# EAGLE design SparkFun_Opto_Isolator_Breakout (EAGLE 9.6.2)
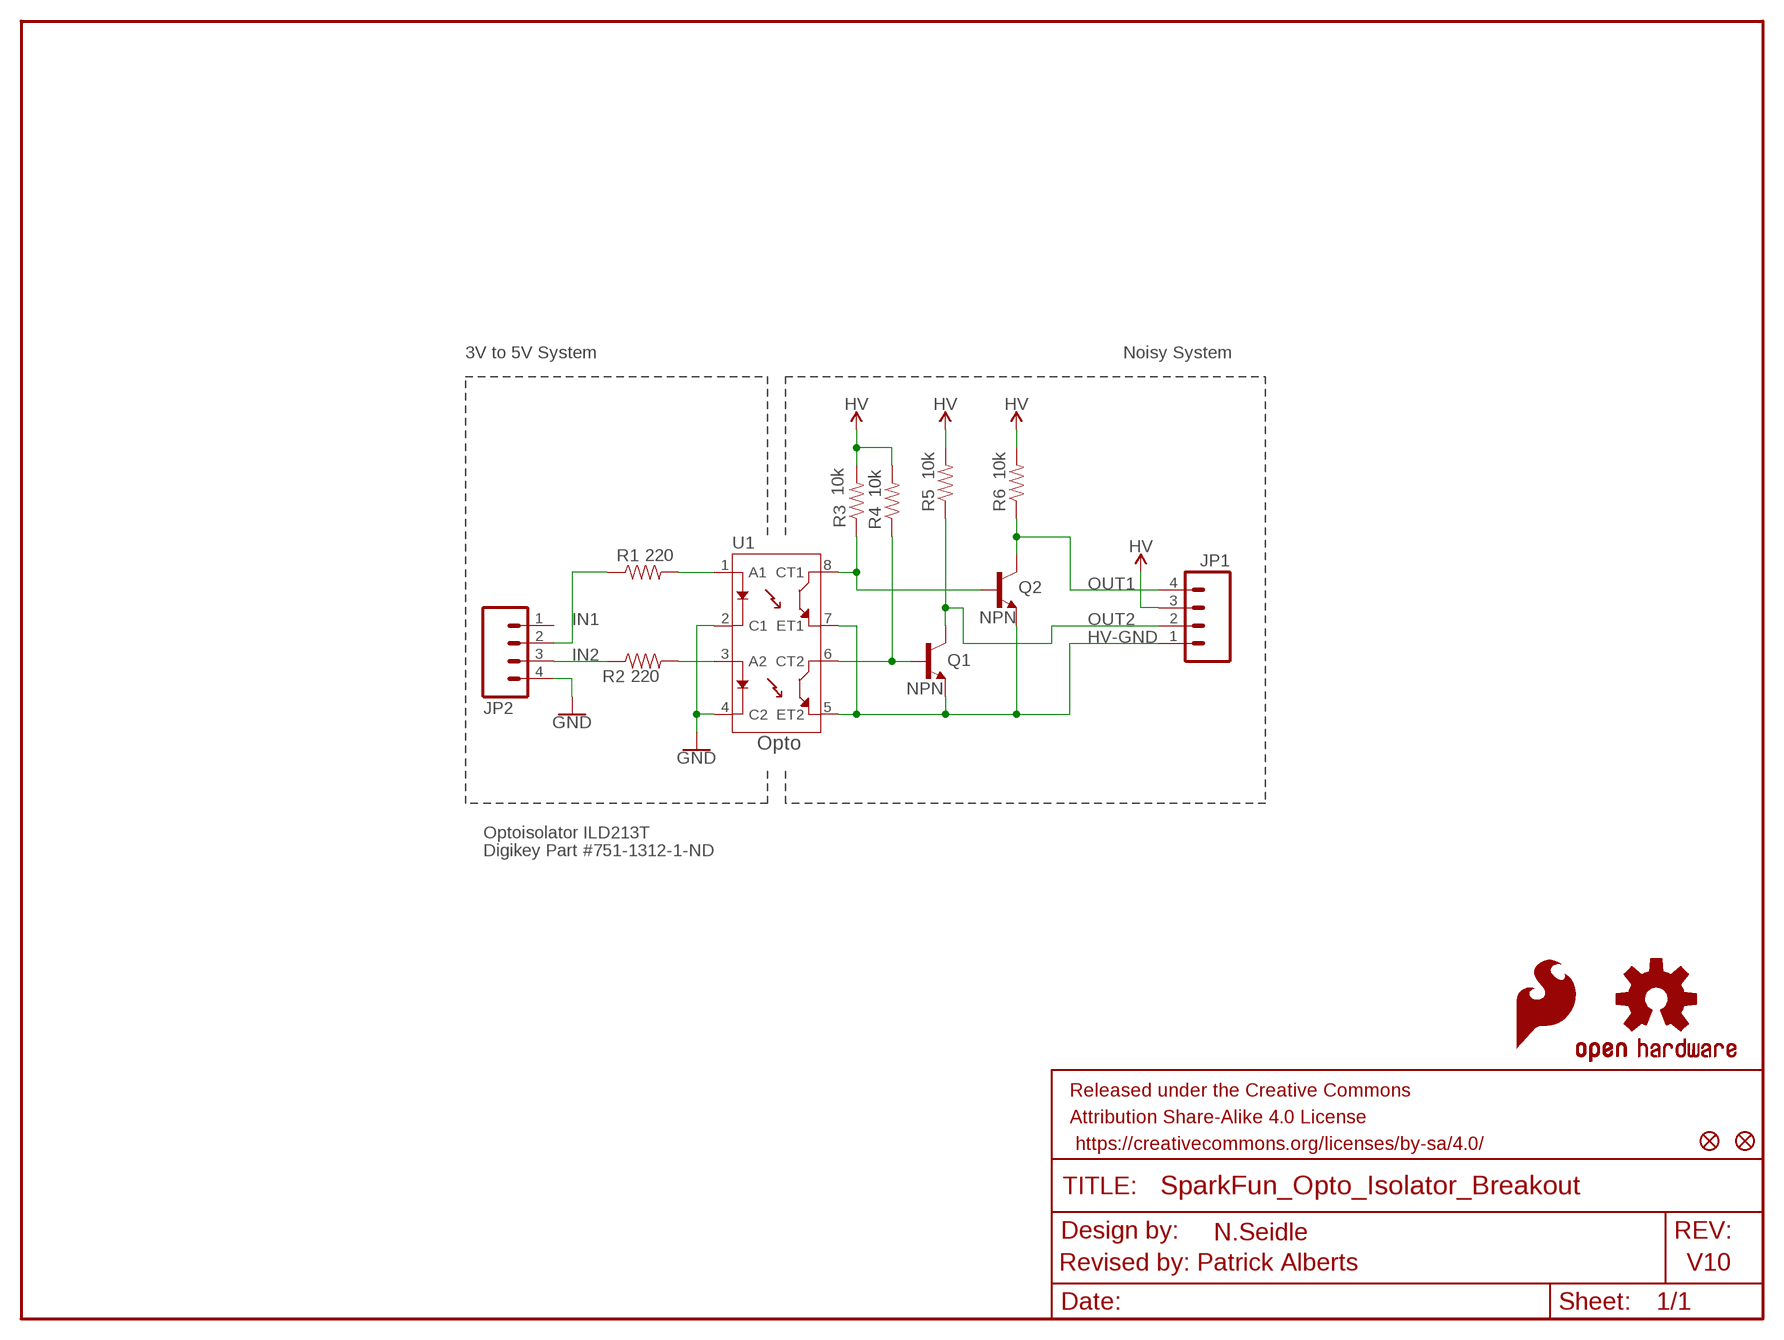
[diagram p0: schematic, sheet 1]

## Parts
FRAME1  FRAME-LETTER  [CREATIVE_COMMONS]
JP1  M04PTH  [1X04]
JP2  M04PTH  [1X04]
LOGO1  OSHW-LOGOS  [OSHW-LOGO-S]
LOGO2  SFE_LOGO_FLAME.1_INCH  [SFE_LOGO_FLAME_.1]
Q1  NPN  TRANSISTOR_NPNMMBT2222A  [SOT23-3]
Q2  NPN  TRANSISTOR_NPNMMBT2222A  [SOT23-3]
R1  220  220OHM-0603-1/10W-1%  [0603]
R2  220  220OHM-0603-1/10W-1%  [0603]
R3  10k  10KOHM-0603-1/10W-1%  [0603]
R4  10k  10KOHM-0603-1/10W-1%  [0603]
R5  10k  10KOHM-0603-1/10W-1%  [0603]
R6  10k  10KOHM-0603-1/10W-1%  [0603]
U1  ILD213T-IDL213T  [SO08]
U$2  FIDUCIALUFIDUCIAL  [MICRO-FIDUCIAL]
U$3  FIDUCIALUFIDUCIAL  [MICRO-FIDUCIAL]

## Nets
GND: JP2.4 U1.2(C1) U1.4(C2)
HV-GND: JP1.1 Q1.2(E) Q2.2(E) U1.5(ET2) U1.7(ET1)
IN1: JP2.2 R1.1
IN2: JP2.3 R2.1
N$1: R1.2 U1.1(A1)
N$2: R2.2 U1.3(A2)
OUT1: JP1.4 Q2.3(C) R6.1
OUT1N: Q2.1(B) R3.1 U1.8(CT1)
OUT2: JP1.2 Q1.3(C) R5.1
OUT2N: Q1.1(B) R4.1 U1.6(CT2)
VCC: JP1.3 R3.2 R4.2 R5.2 R6.2 ; supply symbol labelled HV
Unconnected: JP2.1

## Notes on the sheet
- 3V to 5V System | Noisy System
- Opto
- Optoisolator ILD213T
- Digikey Part #751-1312-1-ND
- N.Seidle
- Revised by: Patrick Alberts | V10

## Library data of the parts
FRAME1 = SparkFun-Aesthetics:FRAME-LETTER: Schematic Frame Standard 8.5x11 US Letter frame; DESIGNER: NAME; VERSION: v01
JP1 JP2 = SparkFun-Connectors:M04: Header 4 Standard 4-pin 0.1" header. Use with straight break away headers (SKU : PRT-00116), right angle break away headers (PRT-00553), swiss pins (PRT-00743), machine pins (PRT-00117), and female headers (PRT-00115). Molex polarized connector foot print use with SKU : PRT-08231 with associated crimp pins and housings. 1MM SMD Version SKU: PRT-10208
LOGO1 = SparkFun-Aesthetics:OSHW-LOGO: Open Source Hardware Logo This logo indicates the piece of hardware it is found on incorporates a OSHW license and/or adheres to the definition of open source hardware found here: http://freedomdefined.org/OSHW
LOGO2 = SparkFun-Aesthetics:SFE_LOGO_FLAME: SFE Logo, flame only This is the SparkFun flame logo. The logo on the schematic will always be the same size; the package variant is the height of the flame. Default layer for the logo on the board is tSilk.
Q1 Q2 = SparkFun-DiscreteSemi:TRANSISTOR_NPN: Generic NPN BJT MMBT2222A - TRANS-08049 (SOT-23, 1A 40V) MPSA42 - TRANS-09116 (SOT-23, 500mA 300V) MMBT5088LT1G - TRANS-11160 (SOT-23, 50 mA 30V) BC547 - COM-08928 <http://www.sparkfun.com/products/8928> (TO-92 45V 100mA) (1.Collector 2.Base 3.Emitter) 2N3904 - COM-00521 <http://www.sparkfun.com/products/521> (TO-92 40V 200mA) (1.Emitter 2.Base 3.Collector) P2N2222A - COM-12852 <http://www.sparkfun.com/products/12852> (TO-92 40V 600mA) (1.Collector 2.Base 3.Emitter); PROD_ID: TRANS-08049; VALUE: MMBT2222A
R1 R2 = SparkFun-Resistors:220OHM: 220Ω resistor A resistor is a passive two-terminal electrical component that implements electrical resistance as a circuit element. Resistors act to reduce current flow, and, at the same time, act to lower voltage levels within circuits. - Wikipedia; PROD_ID: RES-07861
R3-R6 = SparkFun-Resistors:10KOHM: 10kΩ resistor A resistor is a passive two-terminal electrical component that implements electrical resistance as a circuit element. Resistors act to reduce current flow, and, at the same time, act to lower voltage levels within circuits. - Wikipedia; PROD_ID: RES-00824
U1 = SparkFun-DiscreteSemi:ILD213T: Dual Channel Phototransistor Optocoupler Dual Channel 70 V 4000 Vrms Phototransistor Optocoupler in a standard SOIC-8 package. Used to couple signals between electrically isolated circuits. Datasheet <https://www.sparkfun.com/datasheets/Components/SMD/ild205t.pdf> SparkFun Products: SparkFun Opto-Isolator Breakout <https://www.sparkfun.com/products/9118>; PROD_ID: IC-09076
U$2 U$3 = SparkFun-Aesthetics:FIDUCIAL: Fiducial Alignment Points Various fiducial points for machine vision alignment.

## Board
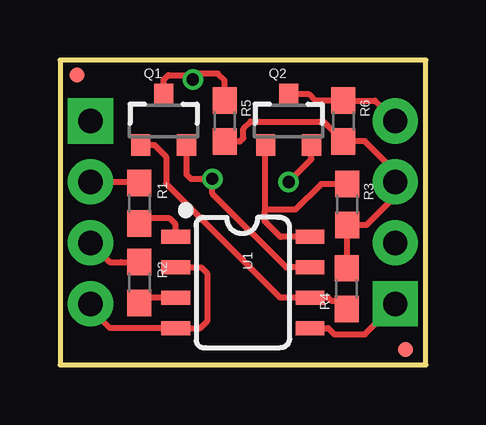
[diagram p1: board, top side]
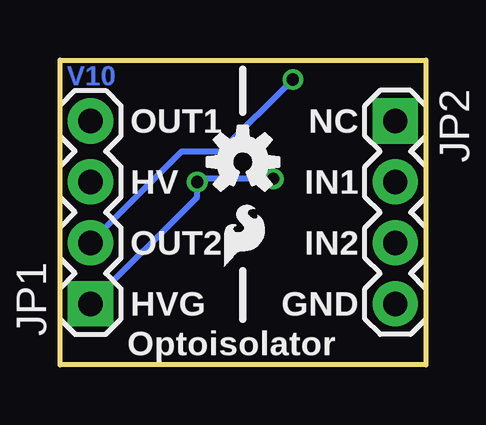
[diagram p2: board, bottom side, seen from below]

Size 15.24 x 12.7 mm. Coordinates in mm from the lower left corner, seen from the top.
Outline: 0,0 15.24,0 15.24,12.7 0,12.7 0,0
Copper layers (1*16): Top 0.035mm / dielectric 1.5mm / Bottom 0.035mm
Design rules "SparkFun-2-Layer-General-JLCPCB": minimum track width 7mil, minimum drill 0.3mm, track to track 7mil, track to pad 7mil, pad to pad 7mil, via to via 7mil, smd to smd 7mil, copper to edge 7mil, drill to drill 7mil, minimum pad ring 7mil, minimum via ring 7mil, stop-mask expansion 3mil, vias tented up to drill 25mil, thermal gap 10mil

### Footprints (pad centres in the part's own frame; a part is rotated, then mirrored left to right if it is on the bottom)
1X04 = drill 1.016 pad 1.88 square: 1 0,0 | drill 1.016 pad 1.88: 2 2.54,0; 3 5.08,0; 4 7.62,0
SOT23-3 = smd 0.8 x 0.9: 1 -0.95,-1; 2 0.95,-1; 3 0,1.1
0603 = smd 1.1 x 1: 1 -0.85,0; 2 0.85,0
SO08 = smd 0.6 x 1.2: 1 -1.905,-2.8; 2 -0.635,-2.8; 3 0.635,-2.8; 4 1.905,-2.8; 5 1.905,2.8; 6 0.635,2.8; 7 -0.635,2.8; 8 -1.905,2.8
MICRO-FIDUCIAL = smd 0.635 x 0.635: 1 0,0

### Placement (x,y rotation side)
FRAME1  -22.72,-12.7 0 top  (outside the outline)
JP1  13.97,2.54 90 bottom
JP2  1.27,10.16 270 bottom
LOGO1  7.62,8.45 0 bottom
LOGO2  8.71,3.75 0 bottom
Q1  4.32,10.16 0 top
Q2  9.53,10.16 0 top
R1  3.3,6.73 270 top
R2  3.3,3.43 270 top
R3  11.96,6.68 270 top
R4  11.94,3.17 90 top
R5  6.86,10.16 270 top
R6  11.81,10.16 270 top
U1  7.62,3.43 270 top
U$2  0.71,12.06 0 top
U$3  14.4,0.64 0 top

### Tracks (layer width: path | path; a pad name or v marks a point on that pad's centre or on a via)
GND
  Top 0.254: JP2.4 1.27,2.34 2.09,1.52 U1.4 5.83,1.52 6.13,1.82 6.13,3.81 5.88,4.06 U1.2
HV-GND  (via drill 0.51)
  Top 0.254: Q2.2 10.47,8.57 v9.53,7.62 | JP1.1 12.7,1.27 11.43,1.27 11.18,1.52 U1.5 | Q1.2 5.27,7.93 5.45,7.75 v6.35,7.75 6.35,7.14 9.42,4.06 U1.7
  Bottom 0.254: JP1.1 9.53,6.99 v9.53,7.62 9.4,7.75 v6.35,7.75
IN1
  Top 0.254: JP2.2 3.26,7.62 R1.1
IN2
  Top 0.254: JP2.3 2.07,4.28 2.54,4.28 R2.1
N$1
  Top 0.254: R1.2 3.52,6.1 4.57,6.1 4.82,5.85 U1.1
N$2
  Top 0.254: U1.3 3.52,2.79 R2.2
OUT1
  Top 0.254: Q2.3 10.38,11.27 10.63,11.01 R6.1 13.12,11.01 JP1.4
OUT1N
  Top 0.254: R3.1 10.88,7.53 9.81,6.47 8.64,6.47 arc90 8.52,6.35 | 8.52,6.35 8.52,5.99 9.19,5.32 9.2,5.33 U1.8 | Q2.1 8.52,9.11 8.52,6.35
OUT2  (via drill 0.51)
  Top 0.254: R5.1 6.86,11.85 6.58,12.13 5.78,12.13 v5.54,11.89 5.36,12.07 4.52,12.07 4.32,11.87 Q1.3
  Bottom 0.254: JP1.2 10.16,8.89 8.53,8.89 v5.54,11.89
OUT2N
  Top 0.254: Q1.1 3.94,9.16 4.42,8.67 4.42,7.55 9.18,2.79 U1.6 11.18,2.79 11.3,2.67 11.6,2.67 R4.1
VCC
  Top 0.254: R4.2 11.96,4.05 R3.2 12.77,5.83 13.97,7.03 JP1.3 13.97,8.05 12.7,9.32 11.82,9.32 R6.2 10.99,10.13 7.94,10.13 7.64,9.83 7.64,9.45 7.5,9.31 R5.2

### Text on the board
Bottom: V10
bPlace: NC | OUT1 | IN1 | HV | IN2 | OUT2 | GND | HVG | Optoisolator
Measures: All units are in inches.
tDocu: N.Seidle | Revised by: Patrick Alberts